# Altium schematic sheet pcbgrado.SchDoc
size 261 x 200 mm; Origin: Eagle
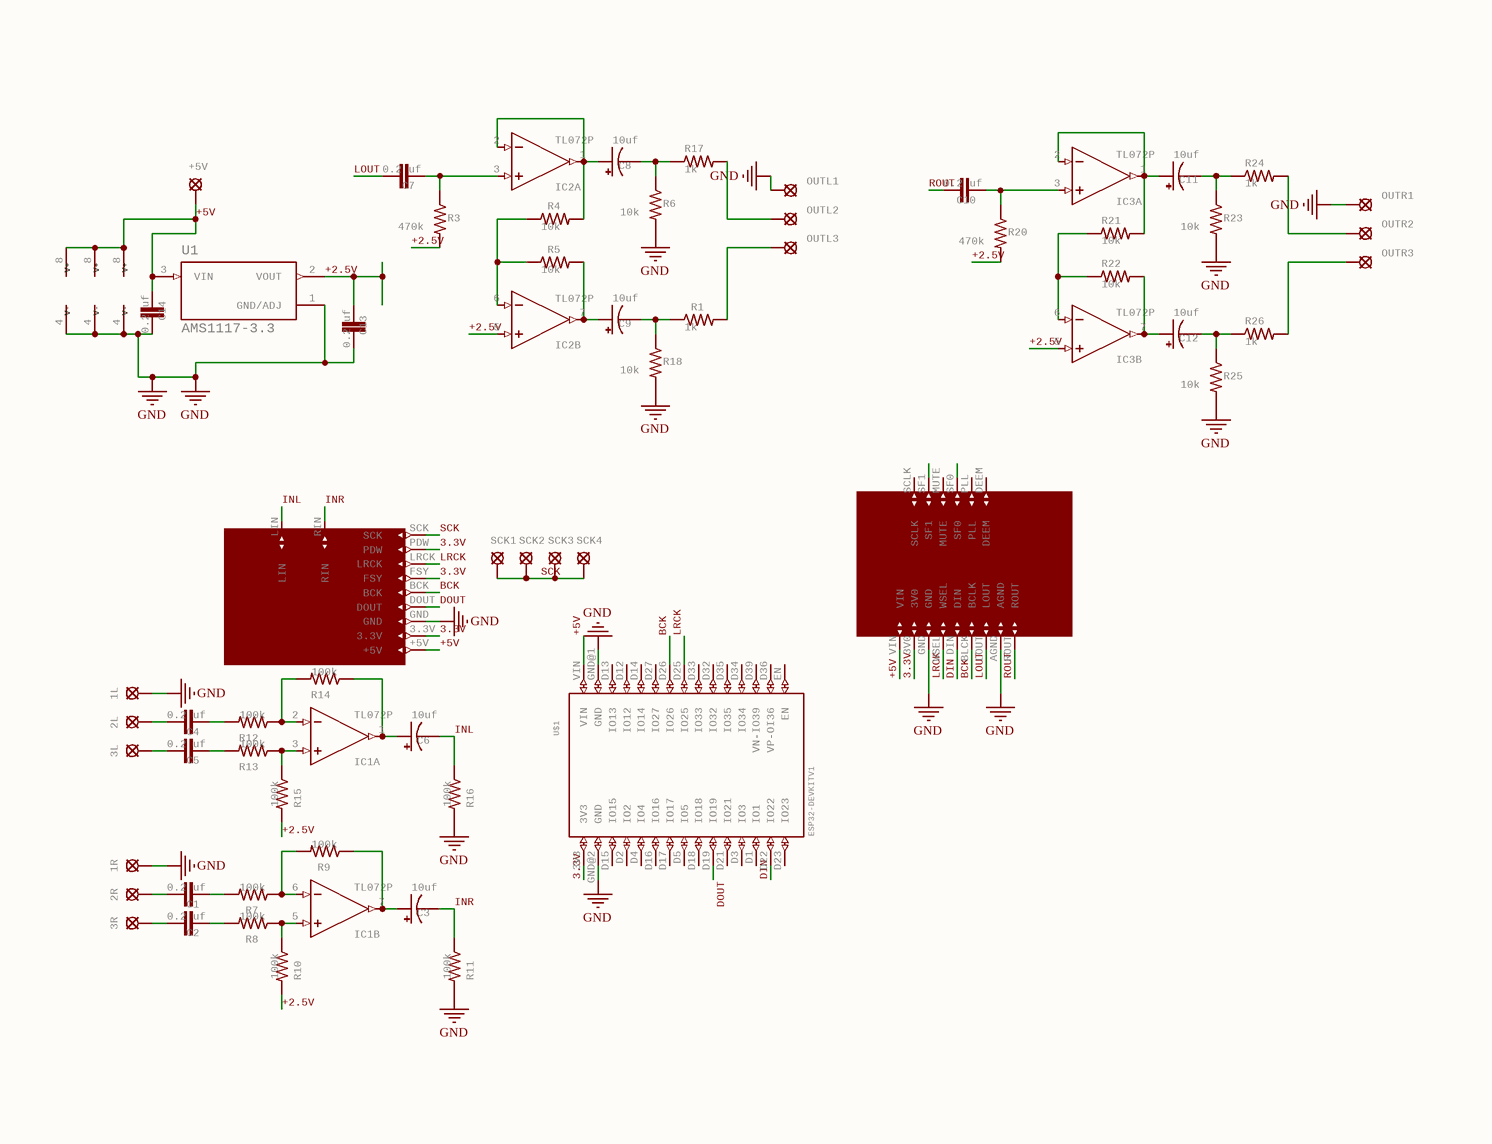
[diagram p0: pcbgrado.SchDoc]

## Parts
1L  LSP10  [LSP10]  (value not drawn)
1R  LSP10  [LSP10]  (value not drawn)
2L  LSP10  [LSP10]  (value not drawn)
2R  LSP10  [LSP10]  (value not drawn)
3L  LSP10  [LSP10]  (value not drawn)
3R  LSP10  [LSP10]  (value not drawn)
+5V  LSP10  [LSP10]  (value not drawn)
C1  POPULARITY: 0.2 uf  [C025-025X050]  (hidden comment: C-EU025-025X050)
C2  POPULARITY: 0.2 uf  [C025-025X050]  (hidden comment: C-EU025-025X050)
C3  POPULARITY: 10uf  [E1,8-4]  (hidden comment: CPOL-USE1.8-4)
C4  POPULARITY: 0.2 uf  [C025-025X050]  (hidden comment: C-EU025-025X050)
C5  POPULARITY: 0.2 uf  [C025-025X050]  (hidden comment: C-EU025-025X050)
C6  POPULARITY: 10uf  [E1,8-4]  (hidden comment: CPOL-USE1.8-4)
C7  POPULARITY: 0.2 uf  [C025-030X050]  (hidden comment: C-EU025-030X050)
C8  POPULARITY: 10uf  [E1,8-4]  (hidden comment: CPOL-USE1.8-4)
C9  POPULARITY: 10uf  [E1,8-4]  (hidden comment: CPOL-USE1.8-4)
C10  POPULARITY: 0.2 uf  [C025-030X050]  (hidden comment: C-EU025-030X050)
C11  POPULARITY: 10uf  [E1,8-4]  (hidden comment: CPOL-USE1.8-4)
C12  POPULARITY: 10uf  [E1,8-4]  (hidden comment: CPOL-USE1.8-4)
C13  POPULARITY: 0.2 uf  [C025-025X050]  (hidden comment: C-EU025-025X050)
C14  POPULARITY: 0.2 uf  [C025-025X050]  (hidden comment: C-EU025-025X050)
IC1  TL072P  [DIL08]  (parts A,B,C of 3)
IC2  TL072P  [DIL08]  (parts A,B,C of 3)
IC3  TL072P  [DIL08]  (parts A,B,C of 3)
OUTL1  LSP10  [LSP10]  (value not drawn)
OUTL2  LSP10  [LSP10]  (value not drawn)
OUTL3  LSP10  [LSP10]  (value not drawn)
OUTR1  LSP10  [LSP10]  (value not drawn)
OUTR2  LSP10  [LSP10]  (value not drawn)
OUTR3  LSP10  [LSP10]  (value not drawn)
R1  POPULARITY: 1k  [0204/7]  (hidden comment: R-US_0204/7)
R3  POPULARITY: 470k  [0204/7]  (hidden comment: R-US_0204/7)
R4  POPULARITY: 10k  [0204/7]  (hidden comment: R-US_0204/7)
R5  POPULARITY: 10k  [0204/7]  (hidden comment: R-US_0204/7)
R6  POPULARITY: 10k  [0204/7]  (hidden comment: R-US_0204/7)
R7  POPULARITY: 100k  [0204/7]  (hidden comment: R-US_0204/7)
R8  POPULARITY: 100k  [0204/7]  (hidden comment: R-US_0204/7)
R9  POPULARITY: 100k  [0204/7]  (hidden comment: R-US_0204/7)
R10  POPULARITY: 100k  [0204/7]  (hidden comment: R-US_0204/7)
R11  POPULARITY: 100k  [0204/7]  (hidden comment: R-US_0204/7)
R12  POPULARITY: 100k  [0204/7]  (hidden comment: R-US_0204/7)
R13  POPULARITY: 100k  [0204/7]  (hidden comment: R-US_0204/7)
R14  POPULARITY: 100k  [0204/7]  (hidden comment: R-US_0204/7)
R15  POPULARITY: 100k  [0204/7]  (hidden comment: R-US_0204/7)
R16  POPULARITY: 100k  [0204/7]  (hidden comment: R-US_0204/7)
R17  POPULARITY: 1k  [0204/7]  (hidden comment: R-US_0204/7)
R18  POPULARITY: 10k  [0204/7]  (hidden comment: R-US_0204/7)
R20  POPULARITY: 470k  [0204/7]  (hidden comment: R-US_0204/7)
R21  POPULARITY: 10k  [0204/7]  (hidden comment: R-US_0204/7)
R22  POPULARITY: 10k  [0204/7]  (hidden comment: R-US_0204/7)
R23  POPULARITY: 10k  [0204/7]  (hidden comment: R-US_0204/7)
R24  POPULARITY: 1k  [0204/7]  (hidden comment: R-US_0204/7)
R25  POPULARITY: 10k  [0204/7]  (hidden comment: R-US_0204/7)
R26  POPULARITY: 1k  [0204/7]  (hidden comment: R-US_0204/7)
SCK1  LSP10  [LSP10]  (value not drawn)
SCK2  LSP10  [LSP10]  (value not drawn)
SCK3  LSP10  [LSP10]  (value not drawn)
SCK4  LSP10  [LSP10]  (value not drawn)
U1  AMS1117-3.3  [SOT229P700X180-4N]
U$1  ESP32DEVKITV1  [ESP32-DEVKITV1]  (value not drawn)
U$2  PCM1802DIS  [PCM1802PC]  (value not drawn)
U$3  UDA1334A  [UDA1334A]  (value not drawn)

## Nets
GND: 1L.MP 1R.MP C13.1 C14.1 IC1.4(V-) IC2.4(V-) IC3.4(V-) OUTL1.MP OUTR1.MP R6.2 R11.2 R16.2 R18.2 R23.2 R25.2 U1.1(GND/ADJ) U$1.GND@1(GND) U$1.GND@2(GND) U$2.GND U$3.AGND U$3.GND
3.3V: U$1.3V3 U$2.3.3V U$2.FSY U$2.PDW U$3.3V0
+2.5V: C13.2 IC2.5(+IN) IC3.5(+IN) R3.2 R10.2 R15.2 R20.2 U1.2(VOUT)
+5V: +5V.MP C14.2 IC1.8(V+) IC2.8(V+) IC3.8(V+) U1.3(VIN) U$1.VIN U$2.+5V U$3.VIN
BCK: U$1.D26(IO26) U$2.BCK U$3.BLCK(BCLK)
DIN: U$1.D22(IO22) U$3.DIN
DOUT: U$1.D19(IO19) U$2.DOUT
INL: C6.- R16.1 U$2.LIN
INR: C3.- R11.1 U$2.RIN
LOUT: C7.1 U$3.LOUT
LRCK: U$1.D25(IO25) U$2.LRCK U$3.WSEL
ROUT: C10.1 U$3.ROUT
SCK: SCK1.MP SCK2.MP SCK3.MP SCK4.MP U$2.SCK
Net2L_MP: 2L.MP C4.1
Net2R_MP: 2R.MP C1.1
Net3L_MP: 3L.MP C5.1
Net3R_MP: 3R.MP C2.1
NetC1_2: C1.2 R7.2
NetC2_2: C2.2 R8.2
NetC3_+: C3.+ IC1.7(OUT) R9.1
NetC4_2: C4.2 R12.2
NetC5_2: C5.2 R13.2
NetC6_+: C6.+ IC1.1(OUT) R14.1
NetC7_2: C7.2 IC2.3(+IN) R3.1
NetC8_+: C8.+ IC2.1(OUT) IC2.2(-IN) R4.2
NetC8_-: C8.- R6.1 R17.1
NetC9_+: C9.+ IC2.7(OUT) R5.2
NetC9_-: C9.- R1.1 R18.1
NetC10_2: C10.2 IC3.3(+IN) R20.1
NetC11_+: C11.+ IC3.1(OUT) IC3.2(-IN) R21.2
NetC11_-: C11.- R23.1 R24.1
NetC12_+: C12.+ IC3.7(OUT) R22.2
NetC12_-: C12.- R25.1 R26.1
NetIC1_2: IC1.2(-IN) R12.1 R14.2
NetIC1_3: IC1.3(+IN) R13.1 R15.1
NetIC1_5: IC1.5(+IN) R8.1 R10.1
NetIC1_6: IC1.6(-IN) R7.1 R9.2
NetIC2_6: IC2.6(-IN) R4.1 R5.1
NetIC3_6: IC3.6(-IN) R21.1 R22.1
NetOUTL2_MP: OUTL2.MP R17.2
NetOUTL3_MP: OUTL3.MP R1.2
NetOUTR2_MP: OUTR2.MP R24.2
NetOUTR3_MP: OUTR3.MP R26.2

Not connected (* = marked no-connect by the designer): U$1 D1(IO1) D2(IO2) D3(IO3) D4(IO4) D5(IO5) D12(IO12) D13(IO13) D14(IO14) D15(IO15) D16(IO16) D17(IO17) D18(IO18) D21(IO21) D23(IO23) D27(IO27) D32(IO32) D33(IO33) D34(IO34) D35(IO35) D36(VP-OI36) D39(VN-IO39) EN; U$3 DEEM MUTE PLL SCLK SF0 SF1

## Library data of the parts
1L 1R 2L 2R 3L 3R +5V OUTL1-OUTL3 OUTR1-OUTR3 SCK1-SCK4 = LSP10: SOLDER PAD    drill 1.0 mm, distributor Buerklin, 12H555; GateName_1: 1; SymbolName_1: LSP; POPULARITY: 52; LibraryName: solpad; DeviceSetName: LSP10
C1 C2 C4 C5 C13 C14 = C-EU025-025X050: CAPACITOR, European symbol; GateName_1: G$1; SymbolName_1: C-EU; DeviceName: 025-025X050; LibraryName: rcl; DeviceSetName: C-EU; SPICEPREFIX: C
C3 C6 C8 C9 C11 C12 = CPOL-USE1.8-4: POLARIZED CAPACITOR, American symbol; GateName_1: G$1; DeviceName: E1.8-4; SymbolName_1: CPOL-US; LibraryName: rcl; DeviceSetName: CPOL-US; SPICEPREFIX: C
C7 C10 = C-EU025-030X050: CAPACITOR, European symbol; GateName_1: G$1; SymbolName_1: C-EU; DeviceName: 025-030X050; LibraryName: rcl; DeviceSetName: C-EU; SPICEPREFIX: C
IC1-IC3 = TL072P: OP AMP; GateName_1: A; SymbolName_1: OPAMP; GateName_2: B; GateName_3: P; SymbolName_3: PWR+-; DeviceSetName: TL072; POPULARITY: 13; SymbolName_2: OPAMP; DeviceName: P; LibraryName: linear
R1 R3-R18 R20-R26 = R-US_0204/7: RESISTOR, American symbol; GateName_1: G$1; SymbolName_1: R-US; DeviceSetName: R-US_; DeviceName: 0204/7; LibraryName: rcl; SPICEPREFIX: R
U1 = AMS1117-3.3: Check availability; GateName_1: G$1; MF: Advanced Monolithic Systems; SymbolName_1: AMS1117-3.3; LibraryName: AMS1117-3.3; DeviceSetName: AMS1117-3.3; AVAILABILITY: In Stock; MP: AMS1117-3.3; PACKAGE: SOT-223 Seeed Technology; PRICE: None; PURCHASE-URL: https://pricing.snapeda.com/search/part/AMS1117-3.3/?ref=eda
U$1 = ESP32DEVKITV1: GateName_1: G$1; SymbolName_1: ESP32-DEVKITV1; LibraryName: ESP32-DEVKITV1; DeviceSetName: ESP32DEVKITV1; ESP32-DEVKITV1: ESP32-DEVKITV1
U$2 = PCM1802DIS: GateName_1: G$1; SymbolName_1: PCM1802; LibraryName: PCM1802SIM; DeviceSetName: PCM1802DIS
U$3 = UDA1334A: GateName_1: G$1; SymbolName_1: UDA314A; LibraryName: uda1334a; DeviceSetName: UDA1334A